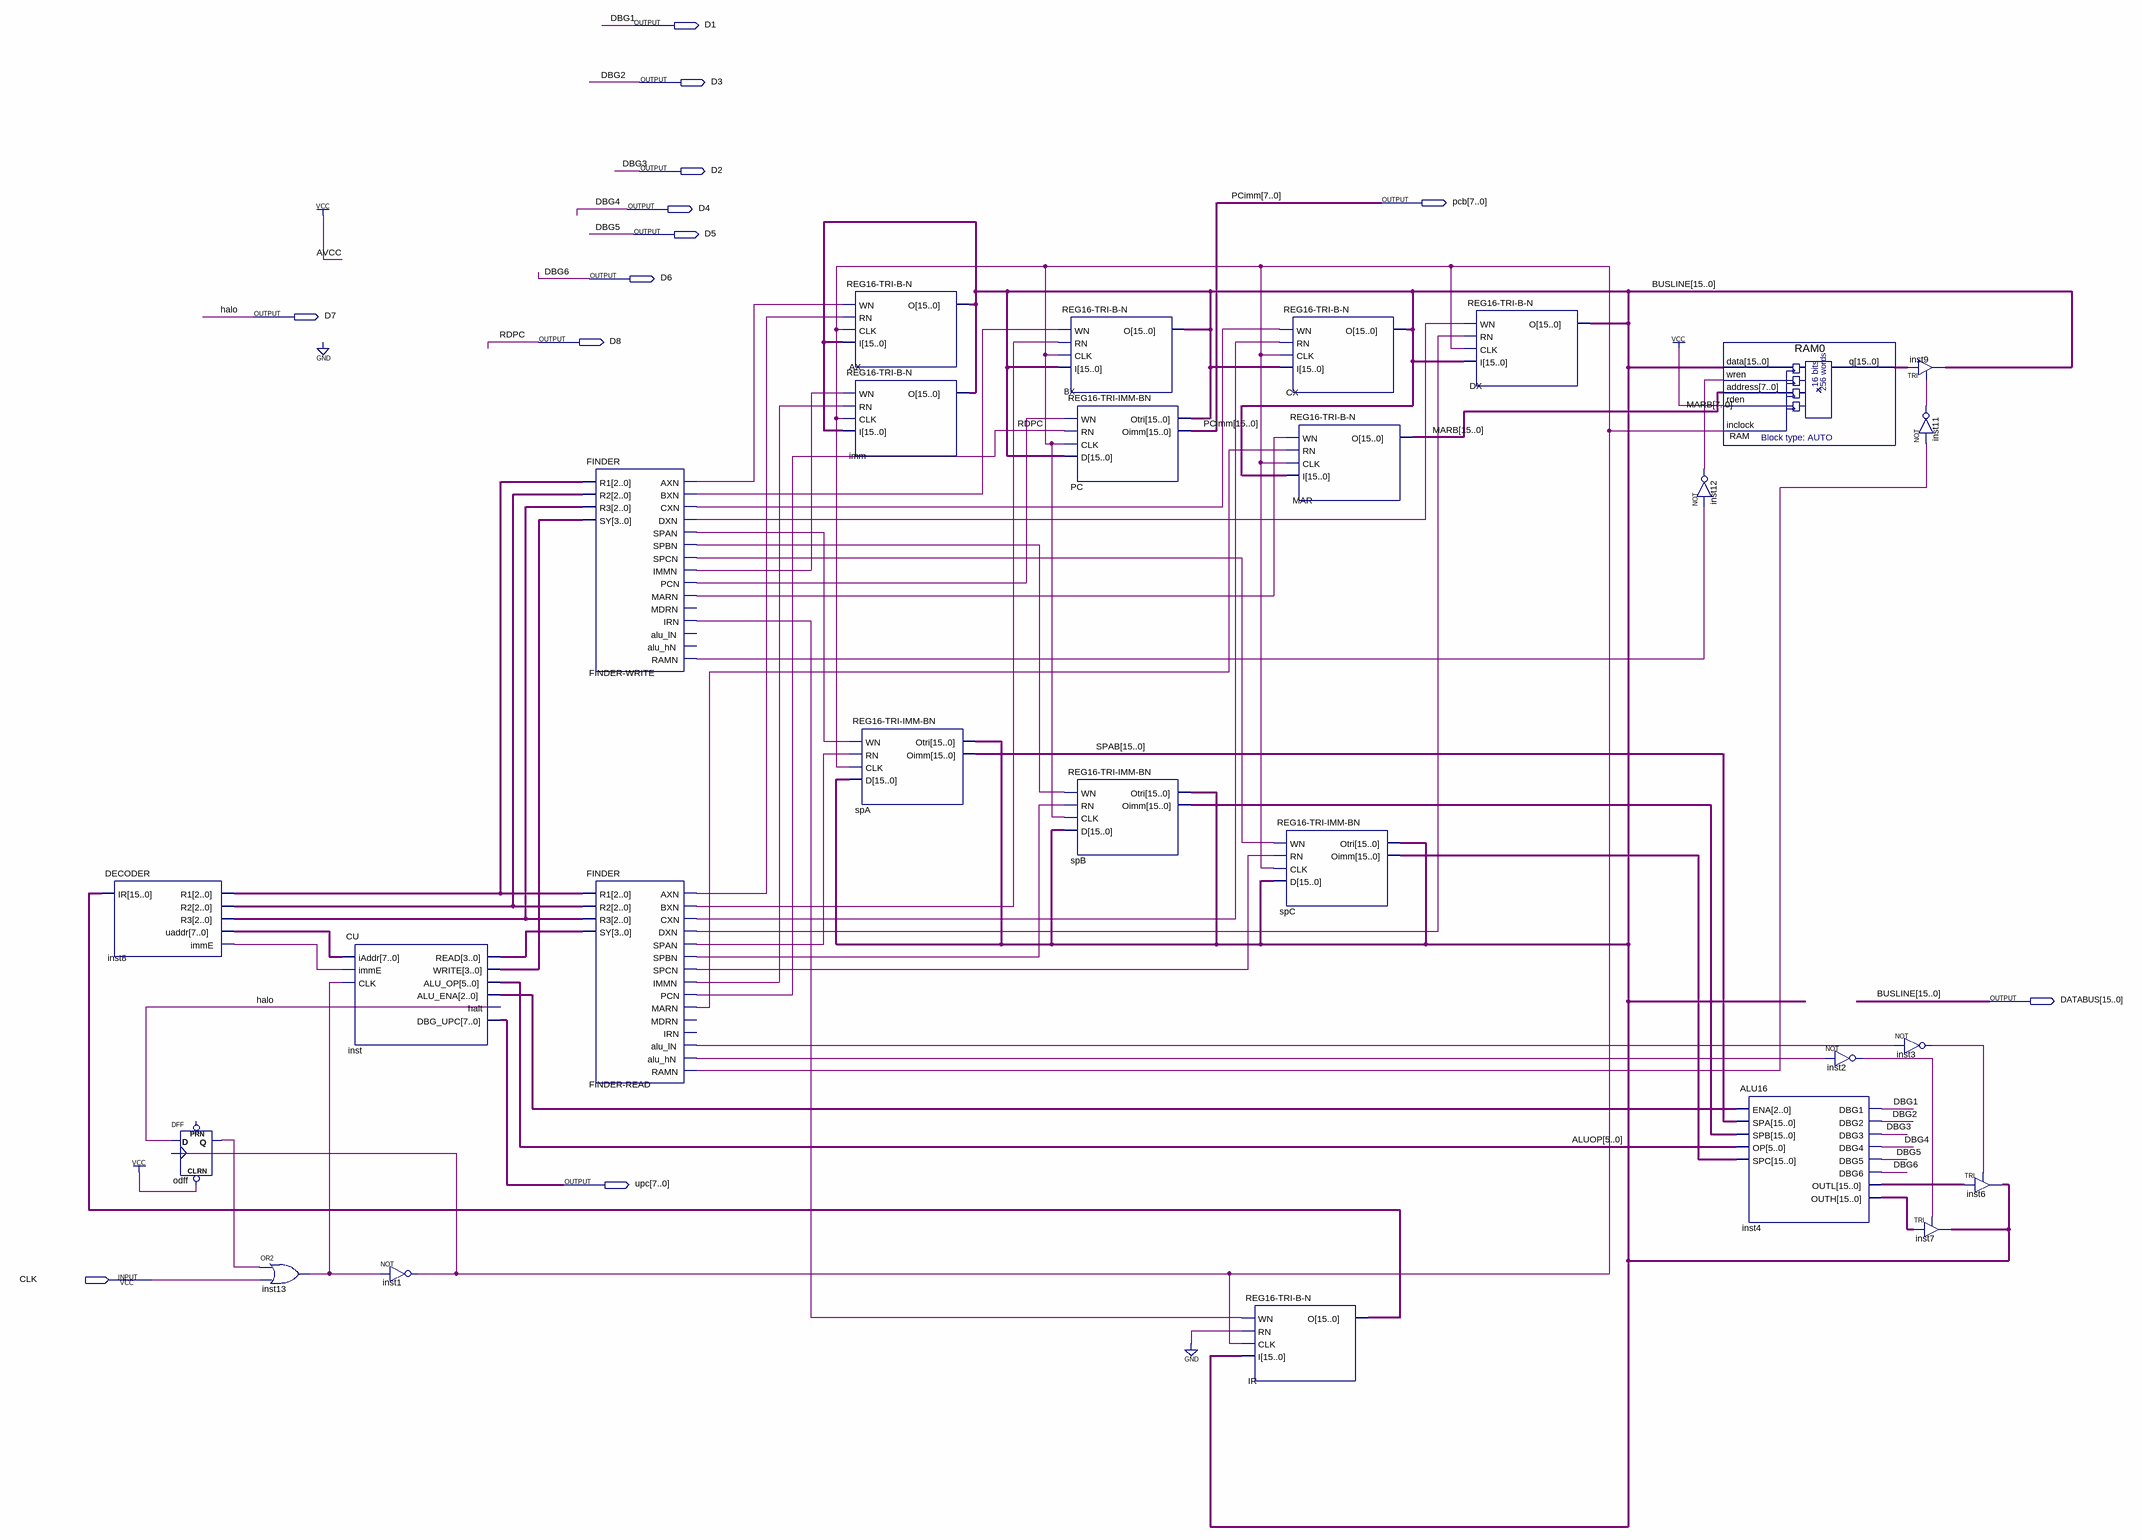
[diagram p0: schematic sheet]
// Quartus schematic EXP3.bdf as structural Verilog: 27 symbols, 12 pins
module EXP3 (
  input  CLK,
  output D1,
  output D3,
  output D2,
  output [7:0] pcb,
  output D4,
  output D5,
  output D6,
  output D7,
  output D8,
  output [15:0] DATABUS,
  output [7:0] upc
);

  wire FINDER_READ_alu_hn, FINDER_READ_alu_ln, FINDER_READ_axn, FINDER_READ_bxn, FINDER_READ_cxn,
       FINDER_READ_dxn, FINDER_READ_immn, FINDER_READ_marn, FINDER_READ_ramn, FINDER_READ_span,
       FINDER_READ_spbn, FINDER_READ_spcn, FINDER_WRITE_axn, FINDER_WRITE_bxn, FINDER_WRITE_cxn,
       FINDER_WRITE_dxn, FINDER_WRITE_immn, FINDER_WRITE_irn, FINDER_WRITE_marn, FINDER_WRITE_pcn,
       FINDER_WRITE_ramn, FINDER_WRITE_span, FINDER_WRITE_spbn, FINDER_WRITE_spcn, inst1_out, inst2_out,
       inst3_out, inst8_imme, inst11_out, inst12_out, inst13_out, odff_q;
  wire [2:0] inst8_r1, inst8_r2, inst8_r3, inst_alu_ena;
  wire [3:0] inst_read, inst_write;
  wire [5:0] ALUOP;
  wire [7:0] inst8_uaddr;
  wire [15:0] inst4_outh, inst4_outl, IR_o, MARB, RAM_q, SPAB, spB_oimm, spC_oimm;
  wire [15:8] PCimm;

  DECODER inst8 (.IR(IR_o), .R1(inst8_r1), .R2(inst8_r2), .R3(inst8_r3), .uaddr(inst8_uaddr), .immE(inst8_imme));
  DFF odff (.CLRN(1'b1), .CLK(inst1_out), .D(D7), .Q(odff_q));  // open: PRN
  or inst13 (inst13_out, odff_q, CLK);
  CU inst (
    .iAddr(inst8_uaddr), .immE(inst8_imme), .CLK(inst13_out), .READ(inst_read), .WRITE(inst_write),
    .ALU_OP(ALUOP), .ALU_ENA(inst_alu_ena), .halt(D7), .DBG_UPC(upc));
  not inst1 (inst1_out, inst13_out);
  FINDER \FINDER-WRITE  (
    .R1(inst8_r1), .R2(inst8_r2), .R3(inst8_r3), .SY(inst_write), .AXN(FINDER_WRITE_axn),
    .BXN(FINDER_WRITE_bxn), .CXN(FINDER_WRITE_cxn), .DXN(FINDER_WRITE_dxn), .SPAN(FINDER_WRITE_span),
    .SPBN(FINDER_WRITE_spbn), .SPCN(FINDER_WRITE_spcn), .IMMN(FINDER_WRITE_immn), .PCN(FINDER_WRITE_pcn),
    .MARN(FINDER_WRITE_marn), .IRN(FINDER_WRITE_irn), .RAMN(FINDER_WRITE_ramn));  // open: MDRN, alu_lN, alu_hN
  FINDER \FINDER-READ  (
    .R1(inst8_r1), .R2(inst8_r2), .R3(inst8_r3), .SY(inst_read), .AXN(FINDER_READ_axn),
    .BXN(FINDER_READ_bxn), .CXN(FINDER_READ_cxn), .DXN(FINDER_READ_dxn), .SPAN(FINDER_READ_span),
    .SPBN(FINDER_READ_spbn), .SPCN(FINDER_READ_spcn), .IMMN(FINDER_READ_immn), .PCN(D8),
    .MARN(FINDER_READ_marn), .alu_lN(FINDER_READ_alu_ln), .alu_hN(FINDER_READ_alu_hn), .RAMN(FINDER_READ_ramn));  // open: MDRN, IRN
  \REG16-TRI-B-N  AX (.WN(FINDER_WRITE_axn), .RN(FINDER_READ_axn), .CLK(inst1_out), .I(DATABUS), .O(DATABUS));
  \REG16-TRI-B-N  imm (.WN(FINDER_WRITE_immn), .RN(FINDER_READ_immn), .CLK(inst1_out), .I(DATABUS), .O(DATABUS));
  \REG16-TRI-IMM-BN  spA (
    .WN(FINDER_WRITE_span), .RN(FINDER_READ_span), .CLK(inst1_out), .D(DATABUS), .Otri(DATABUS), .Oimm(SPAB));
  \REG16-TRI-B-N  BX (.WN(FINDER_WRITE_bxn), .RN(FINDER_READ_bxn), .CLK(inst1_out), .I(DATABUS), .O(DATABUS));
  \REG16-TRI-IMM-BN  PC (
    .WN(FINDER_WRITE_pcn), .RN(D8), .CLK(inst1_out), .D(DATABUS), .Otri(DATABUS), .Oimm({PCimm, pcb}));
  \REG16-TRI-IMM-BN  spB (
    .WN(FINDER_WRITE_spbn), .RN(FINDER_READ_spbn), .CLK(inst1_out), .D(DATABUS), .Otri(DATABUS),
    .Oimm(spB_oimm));
  \REG16-TRI-B-N  CX (.WN(FINDER_WRITE_cxn), .RN(FINDER_READ_cxn), .CLK(inst1_out), .I(DATABUS), .O(DATABUS));
  \REG16-TRI-IMM-BN  spC (
    .WN(FINDER_WRITE_spcn), .RN(FINDER_READ_spcn), .CLK(inst1_out), .D(DATABUS), .Otri(DATABUS),
    .Oimm(spC_oimm));
  \REG16-TRI-B-N  IR (.WN(FINDER_WRITE_irn), .RN(1'b0), .CLK(inst1_out), .I(DATABUS), .O(IR_o));
  \REG16-TRI-B-N  MAR (.WN(FINDER_WRITE_marn), .RN(FINDER_READ_marn), .CLK(inst1_out), .I(DATABUS), .O(MARB));
  \REG16-TRI-B-N  DX (.WN(FINDER_WRITE_dxn), .RN(FINDER_READ_dxn), .CLK(inst1_out), .I(DATABUS), .O(DATABUS));
  RAM0 RAM (.data(DATABUS), .wren(inst12_out), .address(MARB[7:0]), .rden(1'b1), .inclock(inst1_out), .q(RAM_q));
  not inst12 (inst12_out, FINDER_WRITE_ramn);
  ALU16 inst4 (
    .ENA(inst_alu_ena), .SPA(SPAB), .SPB(spB_oimm), .OP(ALUOP), .SPC(spC_oimm), .DBG1(D1), .DBG2(D3),
    .DBG3(D2), .DBG4(D4), .DBG5(D5), .DBG6(D6), .OUTL(inst4_outl), .OUTH(inst4_outh));
  not inst2 (inst2_out, FINDER_READ_alu_hn);
  TRI inst9[15:0] (.IN(RAM_q), .OE(inst11_out), .OUT(DATABUS));
  not inst11 (inst11_out, FINDER_READ_ramn);
  not inst3 (inst3_out, FINDER_READ_alu_ln);
  TRI inst7[15:0] (.IN(inst4_outh), .OE(inst2_out), .OUT(DATABUS));
  TRI inst6[15:0] (.IN(inst4_outl), .OE(inst3_out), .OUT(DATABUS));

  // Other names for the same wires on the sheet: BUSLINE[15:0] = DATABUS; DBG1 = D1; DBG2 = D3; DBG3 = D2; DBG4 = D4;
  //   DBG5 = D5; DBG6 = D6; halo = D7; PCimm[7:0] = pcb; RDPC = D8
endmodule
